# Altium schematic sheet 0_Architecture.SchDoc
size A4
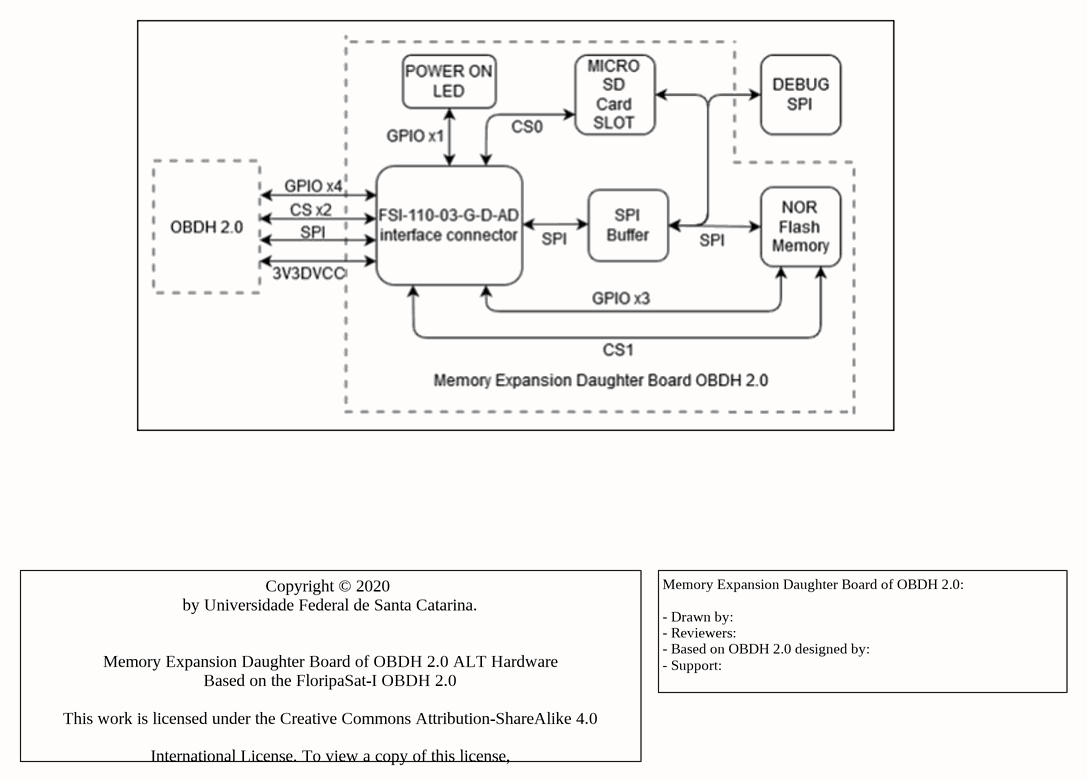
[diagram p0: 0_Architecture.SchDoc]

## Notes on the sheet
- Memory Expansion Daughter Board of OBDH 2.0:
  - Drawn by:
  - Reviewers:
  - Based on OBDH 2.0 designed by:
  - Support:
- Copyright © 2020
  by Universidade Federal de Santa Catarina.
  Memory Expansion Daughter Board of OBDH 2.0 ALT Hardware
  Based on the FloripaSat-I OBDH 2.0
  This work is licensed under the Creative Commons Attribution-ShareAlike 4.0
  International License. To view a copy of this license,
  visit http://creativecommons.org/licenses/by-sa/4.0/.